# Altium project HSBNE-INPUT.PrjPcb
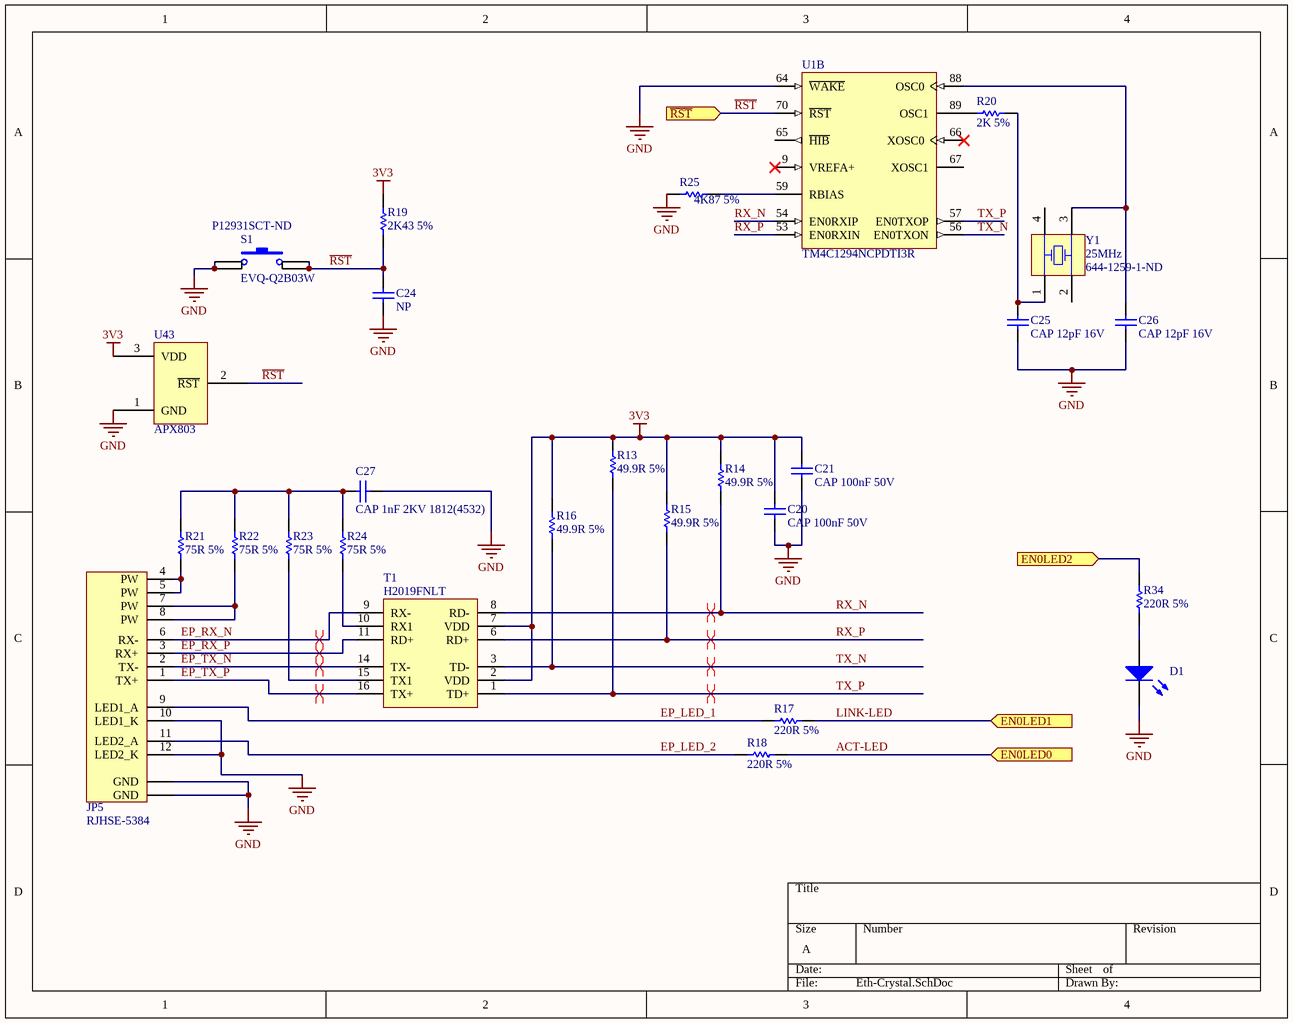
[diagram p0: Eth-Crystal.SchDoc]
3 sheets, 66 parts. Net scope: flat (ports and power ports of the same name join across sheets).
Board file: HSBNE-IO.PcbDoc
Sheets:
  Eth-Crystal.SchDoc
  Micro.SchDoc
  Power.SchDoc

## Sheet Eth-Crystal.SchDoc
size A

### Parts
C20  CAP 100nF 50V  [CAPC0603(1608)100_M]
C21  CAP 100nF 50V  [CAPC0603(1608)100_M]
C24  NP  [0603]
C25  CAP 12pF 16V  [CAPC0603(1608)100_L]
C26  CAP 12pF 16V  [CAPC0603(1608)100_L]
C27  CAP 1nF 2KV 1812(4532)  [CAPC1812(4532)230_N]
D1  LED  [LED-0603]  (value not drawn)
JP5  RJHSE-5384  [RJHSE-5484]
R13  49.9R 5%  [RESC0603(1608)_M]
R14  49.9R 5%  [RESC0603(1608)_M]
R15  49.9R 5%  [RESC0603(1608)_M]
R16  49.9R 5%  [RESC0603(1608)_M]
R17  220R 5%  [RESC0603(1608)_M]
R18  220R 5%  [RESC0603(1608)_M]
R19  2K43 5%  [RESC0603(1608)_M]
R20  2K 5%  [RESC0603(1608)_N]
R21  75R 5%  [RESC0603(1608)_N]
R22  75R 5%  [RESC0603(1608)_N]
R23  75R 5%  [RESC0603(1608)_N]
R24  75R 5%  [RESC0603(1608)_N]
R25  4K87 5%  [RESC0603(1608)_M]
R34  220R 5%  [RESC0603(1608)_M]
S1  EVQ-Q2B03W  Supplier Part Number 1: P12931SCT-ND  [TACTILE_SWITCH_SMD]
T1  H2019FNLT  [HXXXX]
U1  TM4C1294NCPDTI3R  [TI-PDT128_M]  (part B of 3)
U43  APX803  [SOT-23 - ESD]
Y1  Supplier Part Number 1: 644-1259-1-ND  [Crystal 3.2x2.5]  (hidden comment: 25MHz)

### Ports
EN0LED0 (in), EN0LED1 (in), EN0LED2 (in), ~{RST} (in)

### Nets
3V3: C20.2 C21.2 R13.2 R14.2 R15.2 R16.2 R19.2 T1.2(VDD) T1.7(VDD) U43.3(VDD)
GND: C20.1 C21.1 C24.1 C25.1 C26.1 C27.2 D1.2(K) JP5.10(LED1_K) JP5.12(LED2_K) JP5.GND1(GND) JP5.GND2(GND) R25.1 S1.1 S1.2 U1.64(~{WAKE}) U43.1(GND)
ACT-LED: R18.2 ; port EN0LED0
EP_LED_1: JP5.9(LED1_A) R17.1
EP_LED_2: JP5.11(LED2_A) R18.1
EP_RX_N: JP5.6(RX-) T1.9(RX-)
EP_RX_P: JP5.3(RX+) T1.11(RD+)
EP_TX_N: JP5.2(TX-) T1.14(TX-)
EP_TX_P: JP5.1(TX+) T1.16(TX+)
LINK-LED: R17.2 ; port EN0LED1
~{RST}: C24.2 R19.1 S1.3 S1.4 U1.70(~{RST}) U43.2(~{RST}) ; port ~{RST}
RX_N: R14.1 T1.8(RD-) U1.54(EN0RXIP)
RX_P: R15.1 T1.6(RD+) U1.53(EN0RXIN)
TX_N: R16.1 T1.3(TD-) U1.56(EN0TXON)
TX_P: R13.1 T1.1(TD+) U1.57(EN0TXOP)
NetC25_2: C25.2 R20.2 Y1.1(OSC1)
NetC26_2: C26.2 U1.88(OSC0) Y1.3(OSC2)
NetC27_1: C27.1 R21.2 R22.2 R23.2 R24.2
NetD1_1: D1.1(A) R34.1
NetJP5_4: JP5.4(PW) JP5.5(PW) R21.1
NetJP5_7: JP5.7(PW) JP5.8(PW) R22.1
NetR20_1: R20.1 U1.89(OSC1)
NetR23_1: R23.1 T1.15(TX1)
NetR24_1: R24.1 T1.10(RX1)
NetR25_2: R25.2 U1.59(RBIAS)
NetR34_2: R34.2 ; port EN0LED2

Not connected (* = marked no-connect by the designer): U1 9(VREFA+)* 65(~{HIB}) 66(XOSC0)* 67(XOSC1); Y1 2(OSC2) 4(OSC1)

### Layout directives
differential pair: EP_RX_N, EP_RX_P, EP_TX_N, EP_TX_P, RX_N, RX_P, TX_N, TX_P

### Library data of the parts
C20 C21 = CMP-1035-00010-1: CAP 100nF 50V Â±0.1pF 0603 (1608 Metric) Thickness 1mm SMD; Case-Metric: 1608; Case-EIA: 0603; Tolerance: Â±0.1pF; Technology: SMT; Value: 100nF; Max Thickness: 1 mm; Rated Voltage: 50 V
C24 = Cap_100pF: Capacitor (Semiconductor SIM Model); Value: 100pF; Published: 8-Jun-2000; LatestRevisionDate: 29-May-2009; LatestRevisionNote: IPC-7351 Footprint Added.; PackageReference: C1206; Publisher: Altium Limited; PackageDescription: Chip Capacitor
C25 C26 = CMP-1035-00602-1: CAP 12pF 16V Â±0.25pF 0603 (1608 Metric) Thickness 1mm SMD; Case-EIA: 0603; Case-Metric: 1608; Technology: SMT; Value: 12pF; Max Thickness: 1 mm; Rated Voltage: 16 V; Tolerance: Â±0.25pF
C27 = CMP-1040-00330-1: CAP 1nF 2KV Â±10% 1812 (4532 Metric) Thickness 2.3mm SMD; Case-EIA: 1812; Case-Metric: 4532; Technology: SMT; Tolerance: Â±10%; Value: 1nF; Max Thickness: 2.3 mm; Rated Voltage: 2K V
D1 = LED: Typical RED, GREEN, YELLOW, AMBER GaAs LED; Published: 8-Jun-2000; LatestRevisionDate: 17-Jul-2002; LatestRevisionNote: Re-released for DXP Platform.; PackageVersion: Feb-2002; PackageReference: 3.2X1.6X1.1; Publisher: Altium Limited; PackageDescription: SM LED; 2 Flat Leads; Supplier 1: Digi-Key; Supplier 2: Mouser; Supplier Part Number 1: 475-1409-1-ND; Supplier Part Number 2: 720-LGQ971-KN-1
JP5 = Ethernet Socket: Ethernet Socket RJ45 With Leds; Supplier 1: Digi-Key; Supplier 2: Mouser; Supplier Part Number 1: RJHSE-5384-ND; Supplier Part Number 2: 523-RJHSE-5484
R13-R16 = CMP-1012-00042-1: 49.9R 0.1W 5% 0603 (1608 Metric)  SMD; Value: 49.90 Ohm; Case-Metric: 1608; Case-EIA: 0603; Tolerance: 5 %; Technology: SMT; Power: 0.1 W
R17 R18 R34 = CMP-1012-00058-1: 220R 0.1W 5% 0603 (1608 Metric)  SMD; Case-EIA: 0603; Case-Metric: 1608; Value: 220.00 Ohm; Technology: SMT; Power: 0.1 W; Tolerance: 5 %
R19 = CMP-1012-00083-1: 2K43 0.1W 5% 0603 (1608 Metric)  SMD; Value: 2430.00 Ohm; Case-Metric: 1608; Case-EIA: 0603; Tolerance: 5 %; Technology: SMT; Power: 0.1 W
R20 = CMP-1012-00081-1: 2K 0.1W 5% 0603 (1608 Metric)  SMD; Case-Metric: 1608; Value: 2000.00 Ohm; Case-EIA: 0603; Tolerance: 5 %; Technology: SMT; Power: 0.1 W
R21-R24 = CMP-1012-00047-1: 75R 0.1W 5% 0603 (1608 Metric)  SMD; Case-EIA: 0603; Value: 75.00 Ohm; Case-Metric: 1608; Technology: SMT; Tolerance: 5 %; Power: 0.1 W
R25 = CMP-1012-00090-1: 4K87 0.1W 5% 0603 (1608 Metric)  SMD; Case-Metric: 1608; Value: 4K87.00 Ohm; Case-EIA: 0603; Tolerance: 5 %; Technology: SMT; Power: 0.1 W
S1 = SW-PB: Switch; Published: 24-Mar-1999; LatestRevisionDate: 17-Jul-2002; LatestRevisionNote: Re-released for DXP Platform.; PackageReference: SPST-2; Publisher: Altium Limited; PackageDescription: Switch; 2 Leads; Supplier 1: Digi-Key
T1 = Magnetics: Power over Ethernet Magnetic Module; Published: 24-Mar-1999; LatestRevisionDate: 17-Jul-2002; LatestRevisionNote: Re-released for DXP Platform.; PackageReference: MODULE5B; Publisher: Altium Limited; Supplier 1: Digi-Key; Supplier 2: Mouser; Supplier Part Number 2: 673-H2019FNLT
U1 = CMP-0945-00007-1: Tiva C Series Microcontroller, 1024 KB Flash, 256 KB SRAM, 12 Bit, 20 Channels, -40 to 85 degC, 128-Pin TQFP (PDT), Green (RoHS & no Sb/Br), Tape and Reel; Manufacturer: Texas Instruments; SRAM: 256 KB; ADC Resolution: 12 Bits; ADC Channels: 20; Flash: 1024 KB; Max Speed: 120 MHz; CPU: ARM Cortex-M4; Packing: Tape and Reel; Mounting Technology: Surface Mount; Eco-Plan: Green (RoHS & no Sb/Br); ComponentLink1URL: http://www.ti.com/; ComponentLink3Description: Package Specification; ComponentLink2Description: Datasheet; PartNumber: TM4C1294NCPDTI3R; DatasheetVersion: 15863.2743; ComponentLink1Description: Manufacturer URL; ComponentLink3URL: http://www.ti.com/lit/ml/mpqf013/mpqf013.pdf; Temperature Range: -40 to 85 degC; ComponentLink2URL: http://www.ti.com/lit/ds/symlink/tm4c1294ncpdt.pdf; PackageVersion: 4087726/A; PackageDescription: 128-Pin Thin Quad Flat Package, Body 14 x 14 mm, Pitch 0.4 mm; PartId: 2
U43 = APX803: IC MPU RESET CIRC 3.08V SOT23R-3; Supplier 1: Digi-Key; Supplier Part Number 1: APX803-31SRG-7DICT-ND
Y1 = Crystal_25MHz: Surface Mount Quartz Crystal; Note: PCB layout complies with manufacturer's recommendation.; Published: 17-Jul-2002; DatasheetDocument: 28-Aug-2001; PackageDocument: 28-Aug-2001; PackageReference: 91SMX; Publisher: Altium Limited; ComponentLink1Description: Manufacturer Link; ComponentLink1URL: http://www.cmac.com/mt/; ComponentLink2Description: Datasheet; ComponentLink2URL: http://www.cmac.com/mt/databook/crystals/smd/90_91_smx.pdf; Value: 25MHz; Supplier 1: Digi-Key

## Sheet Micro.SchDoc
size A
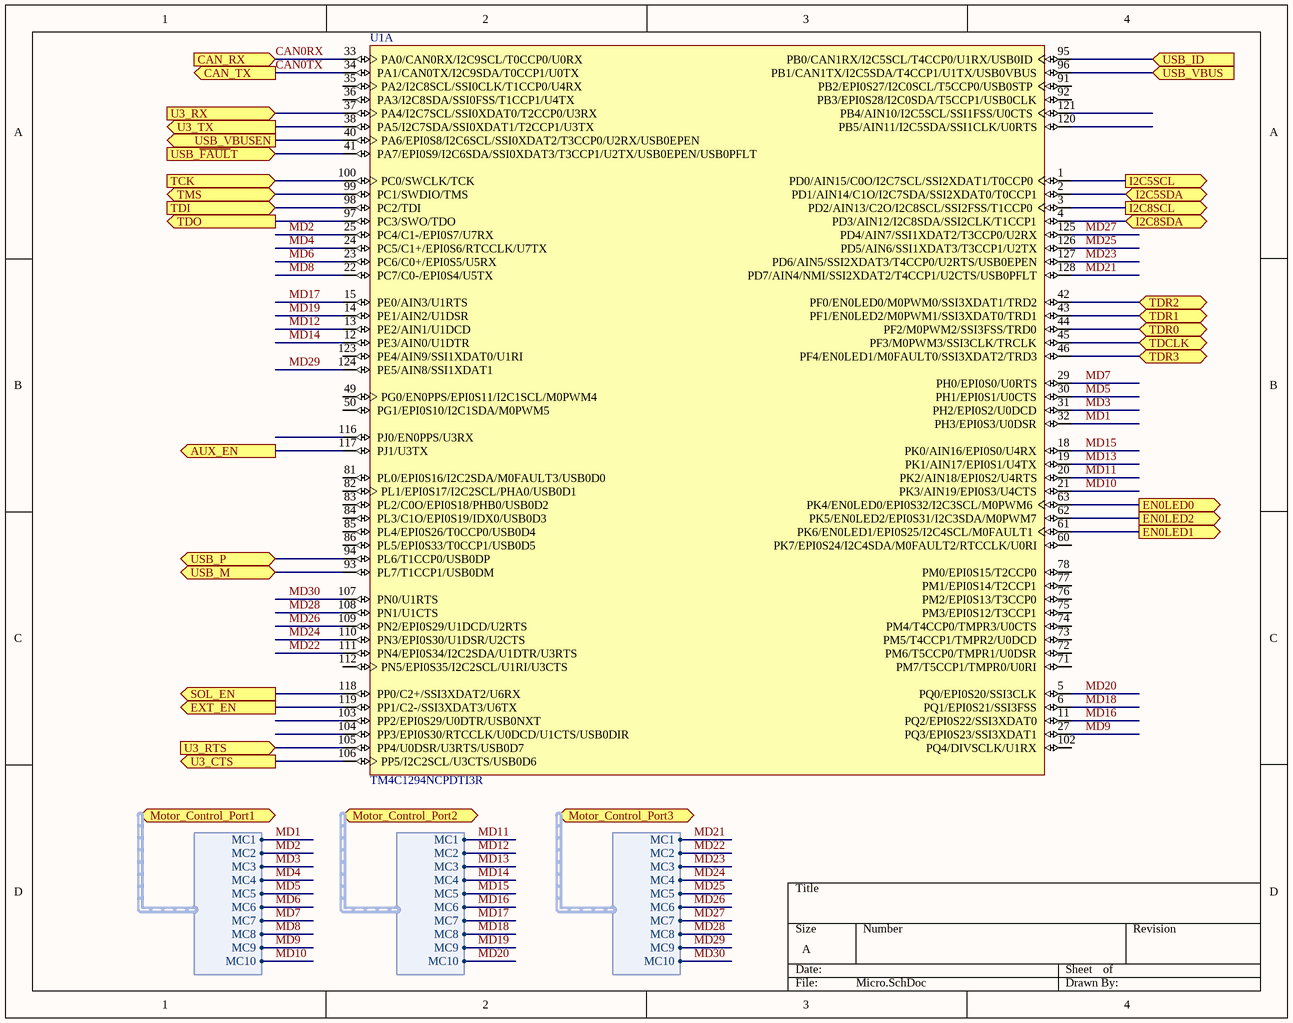
[diagram p1: Micro.SchDoc]

### Parts
U1  TM4C1294NCPDTI3R  [TI-PDT128_M]  (part A of 3)

### Ports
AUX_EN (out), CAN_RX (in), CAN_TX (out), EN0LED0 (out), EN0LED1 (out), EN0LED2 (out), EXT_EN (out), I2C5SCL (out), I2C5SDA (bidir), I2C8SCL (out), I2C8SDA (bidir), Motor_Control_Port1 (harness MCP), Motor_Control_Port2 (harness MCP), Motor_Control_Port3 (harness MCP), SOL_EN (out), TCK (in), TDCLK (bidir), TDI (in), TDO (out), TDR0 (bidir), TDR1 (bidir), TDR2 (bidir), TDR3 (bidir), TMS (bidir), U3_CTS (out), U3_RTS (in), U3_RX (in), U3_TX (out), USB_ID (in), USB_M (bidir), USB_P (bidir), USB_VBUS (in), USB_VBUSEN (out), USB_~{FAUL}T (in)

### Harnesses
MCP: MC1, MC2, MC3, MC4, MC5, MC6, MC7, MC8, MC9, MC10

### Nets
ACT-LED: U1.63(PK4/EN0LED0/EPI0S32/I2C3SCL/M0PWM6) ; port EN0LED0
CAN0RX: U1.33(PA0/CAN0RX/I2C9SCL/T0CCP0/U0RX) ; port CAN_RX
CAN0TX: U1.34(PA1/CAN0TX/I2C9SDA/T0CCP1/U0TX) ; port CAN_TX
LINK-LED: U1.61(PK6/EN0LED1/EPI0S25/I2C4SCL/M0FAULT1) ; port EN0LED1
MD1: U1.32(PH3/EPI0S3/U0DSR) ; port Motor_Control_Port1.MC1
MD2: U1.25(PC4/C1-/EPI0S7/U7RX) ; port Motor_Control_Port1.MC2
MD3: U1.31(PH2/EPI0S2/U0DCD) ; port Motor_Control_Port1.MC3
MD4: U1.24(PC5/C1+/EPI0S6/RTCCLK/U7TX) ; port Motor_Control_Port1.MC4
MD5: U1.30(PH1/EPI0S1/U0CTS) ; port Motor_Control_Port1.MC5
MD6: U1.23(PC6/C0+/EPI0S5/U5RX) ; port Motor_Control_Port1.MC6
MD7: U1.29(PH0/EPI0S0/U0RTS) ; port Motor_Control_Port1.MC7
MD8: U1.22(PC7/C0-/EPI0S4/U5TX) ; port Motor_Control_Port1.MC8
MD9: U1.27(PQ3/EPI0S23/SSI3XDAT1) ; port Motor_Control_Port1.MC9
MD10: U1.21(PK3/AIN19/EPI0S3/U4CTS) ; port Motor_Control_Port1.MC10
MD11: U1.20(PK2/AIN18/EPI0S2/U4RTS) ; port Motor_Control_Port2.MC1
MD12: U1.13(PE2/AIN1/U1DCD) ; port Motor_Control_Port2.MC2
MD13: U1.19(PK1/AIN17/EPI0S1/U4TX) ; port Motor_Control_Port2.MC3
MD14: U1.12(PE3/AIN0/U1DTR) ; port Motor_Control_Port2.MC4
MD15: U1.18(PK0/AIN16/EPI0S0/U4RX) ; port Motor_Control_Port2.MC5
MD16: U1.11(PQ2/EPI0S22/SSI3XDAT0) ; port Motor_Control_Port2.MC6
MD17: U1.15(PE0/AIN3/U1RTS) ; port Motor_Control_Port2.MC7
MD18: U1.6(PQ1/EPI0S21/SSI3FSS) ; port Motor_Control_Port2.MC8
MD19: U1.14(PE1/AIN2/U1DSR) ; port Motor_Control_Port2.MC9
MD20: U1.5(PQ0/EPI0S20/SSI3CLK) ; port Motor_Control_Port2.MC10
MD21: U1.128(PD7/AIN4/NMI/SSI2XDAT2/T4CCP1/U2CTS/USB0PFLT) ; port Motor_Control_Port3.MC1
MD22: U1.111(PN4/EPI0S34/I2C2SDA/U1DTR/U3RTS) ; port Motor_Control_Port3.MC2
MD23: U1.127(PD6/AIN5/SSI2XDAT3/T4CCP0/U2RTS/USB0EPEN) ; port Motor_Control_Port3.MC3
MD24: U1.110(PN3/EPI0S30/U1DSR/U2CTS) ; port Motor_Control_Port3.MC4
MD25: U1.126(PD5/AIN6/SSI1XDAT3/T3CCP1/U2TX) ; port Motor_Control_Port3.MC5
MD26: U1.109(PN2/EPI0S29/U1DCD/U2RTS) ; port Motor_Control_Port3.MC6
MD27: U1.125(PD4/AIN7/SSI1XDAT2/T3CCP0/U2RX) ; port Motor_Control_Port3.MC7
MD28: U1.108(PN1/U1CTS) ; port Motor_Control_Port3.MC8
MD29: U1.124(PE5/AIN8/SSI1XDAT1) ; port Motor_Control_Port3.MC9
MD30: U1.107(PN0/U1RTS) ; port Motor_Control_Port3.MC10
NetR26_2: U1.117(PJ1/U3TX) ; port AUX_EN
NetR27_2: U1.118(PP0/C2+/SSI3XDAT2/U6RX) ; port SOL_EN
NetR28_2: U1.119(PP1/C2-/SSI3XDAT3/U6TX) ; port EXT_EN
NetR34_2: U1.62(PK5/EN0LED2/EPI0S31/I2C3SDA/M0PWM7) ; port EN0LED2
NetU1_1: U1.1(PD0/AIN15/C0O/I2C7SCL/SSI2XDAT1/T0CCP0) ; port I2C5SCL
NetU1_2: U1.2(PD1/AIN14/C1O/I2C7SDA/SSI2XDAT0/T0CCP1) ; port I2C5SDA
NetU1_3: U1.3(PD2/AIN13/C2O/I2C8SCL/SSI2FSS/T1CCP0) ; port I2C8SCL
NetU1_4: U1.4(PD3/AIN12/I2C8SDA/SSI2CLK/T1CCP1) ; port I2C8SDA
NetU1_37: U1.37(PA4/I2C7SCL/SSI0XDAT0/T2CCP0/U3RX) ; port U3_RX
NetU1_38: U1.38(PA5/I2C7SDA/SSI0XDAT1/T2CCP1/U3TX) ; port U3_TX
NetU1_40: U1.40(PA6/EPI0S8/I2C6SCL/SSI0XDAT2/T3CCP0/U2RX/USB0EPEN) ; port USB_VBUSEN
NetU1_41: U1.41(PA7/EPI0S9/I2C6SDA/SSI0XDAT3/T3CCP1/U2TX/USB0EPEN/USB0PFLT) ; port USB_~{FAUL}T
NetU1_42: U1.42(PF0/EN0LED0/M0PWM0/SSI3XDAT1/TRD2) ; port TDR2
NetU1_43: U1.43(PF1/EN0LED2/M0PWM1/SSI3XDAT0/TRD1) ; port TDR1
NetU1_44: U1.44(PF2/M0PWM2/SSI3FSS/TRD0) ; port TDR0
NetU1_45: U1.45(PF3/M0PWM3/SSI3CLK/TRCLK) ; port TDCLK
NetU1_46: U1.46(PF4/EN0LED1/M0FAULT0/SSI3XDAT2/TRD3) ; port TDR3
NetU1_93: U1.93(PL7/T1CCP1/USB0DM) ; port USB_M
NetU1_94: U1.94(PL6/T1CCP0/USB0DP) ; port USB_P
NetU1_95: U1.95(PB0/CAN1RX/I2C5SCL/T4CCP0/U1RX/USB0ID) ; port USB_ID
NetU1_96: U1.96(PB1/CAN1TX/I2C5SDA/T4CCP1/U1TX/USB0VBUS) ; port USB_VBUS
NetU1_97: U1.97(PC3/SWO/TDO) ; port TDO
NetU1_98: U1.98(PC2/TDI) ; port TDI
NetU1_99: U1.99(PC1/SWDIO/TMS) ; port TMS
NetU1_100: U1.100(PC0/SWCLK/TCK) ; port TCK
NetU1_105: U1.105(PP4/U0DSR/U3RTS/USB0D7) ; port U3_RTS
NetU1_106: U1.106(PP5/I2C2SCL/U3CTS/USB0D6) ; port U3_CTS

Not connected (* = marked no-connect by the designer): U1 35(PA2/I2C8SCL/SSI0CLK/T1CCP0/U4RX) 36(PA3/I2C8SDA/SSI0FSS/T1CCP1/U4TX) 49(PG0/EN0PPS/EPI0S11/I2C1SCL/M0PWM4) 50(PG1/EPI0S10/I2C1SDA/M0PWM5) 60(PK7/EPI0S24/I2C4SDA/M0FAULT2/RTCCLK/U0RI) 71(PM7/T5CCP1/TMPR0/U0RI) 72(PM6/T5CCP0/TMPR1/U0DSR) 73(PM5/T4CCP1/TMPR2/U0DCD) 74(PM4/T4CCP0/TMPR3/U0CTS) 75(PM3/EPI0S12/T3CCP1) 76(PM2/EPI0S13/T3CCP0) 77(PM1/EPI0S14/T2CCP1) 78(PM0/EPI0S15/T2CCP0) 81(PL0/EPI0S16/I2C2SDA/M0FAULT3/USB0D0) 82(PL1/EPI0S17/I2C2SCL/PHA0/USB0D1) 83(PL2/C0O/EPI0S18/PHB0/USB0D2) 84(PL3/C1O/EPI0S19/IDX0/USB0D3) 85(PL4/EPI0S26/T0CCP0/USB0D4) 86(PL5/EPI0S33/T0CCP1/USB0D5) 91(PB2/EPI0S27/I2C0SCL/T5CCP0/USB0STP) 92(PB3/EPI0S28/I2C0SDA/T5CCP1/USB0CLK) 102(PQ4/DIVSCLK/U1RX) 103(PP2/EPI0S29/U0DTR/USB0NXT) 104(PP3/EPI0S30/RTCCLK/U0DCD/U1CTS/USB0DIR) 112(PN5/EPI0S35/I2C2SCL/U1RI/U3CTS) 116(PJ0/EN0PPS/U3RX) 120(PB5/AIN11/I2C5SDA/SSI1CLK/U0RTS) 121(PB4/AIN10/I2C5SCL/SSI1FSS/U0CTS) 123(PE4/AIN9/SSI1XDAT0/U1RI)

### Library data of the parts
U1 = CMP-0945-00007-1: as U1 on sheet Eth-Crystal; Packing: Tape and Reel; Mounting Technology: Surface Mount; Eco-Plan: Green (RoHS & no Sb/Br); ComponentLink1URL: http://www.ti.com/; ComponentLink3Description: Package Specification; ComponentLink2Description: Datasheet; PartNumber: TM4C1294NCPDTI3R; DatasheetVersion: 15863.2743; ComponentLink1Description: Manufacturer URL; ComponentLink3URL: http://www.ti.com/lit/ml/mpqf013/mpqf013.pdf; Temperature Range: -40 to 85 degC; ComponentLink2URL: http://www.ti.com/lit/ds/symlink/tm4c1294ncpdt.pdf; PackageVersion: 4087726/A; PackageDescription: 128-Pin Thin Quad Flat Package, Body 14 x 14 mm, Pitch 0.4 mm

## Sheet Power.SchDoc
size A
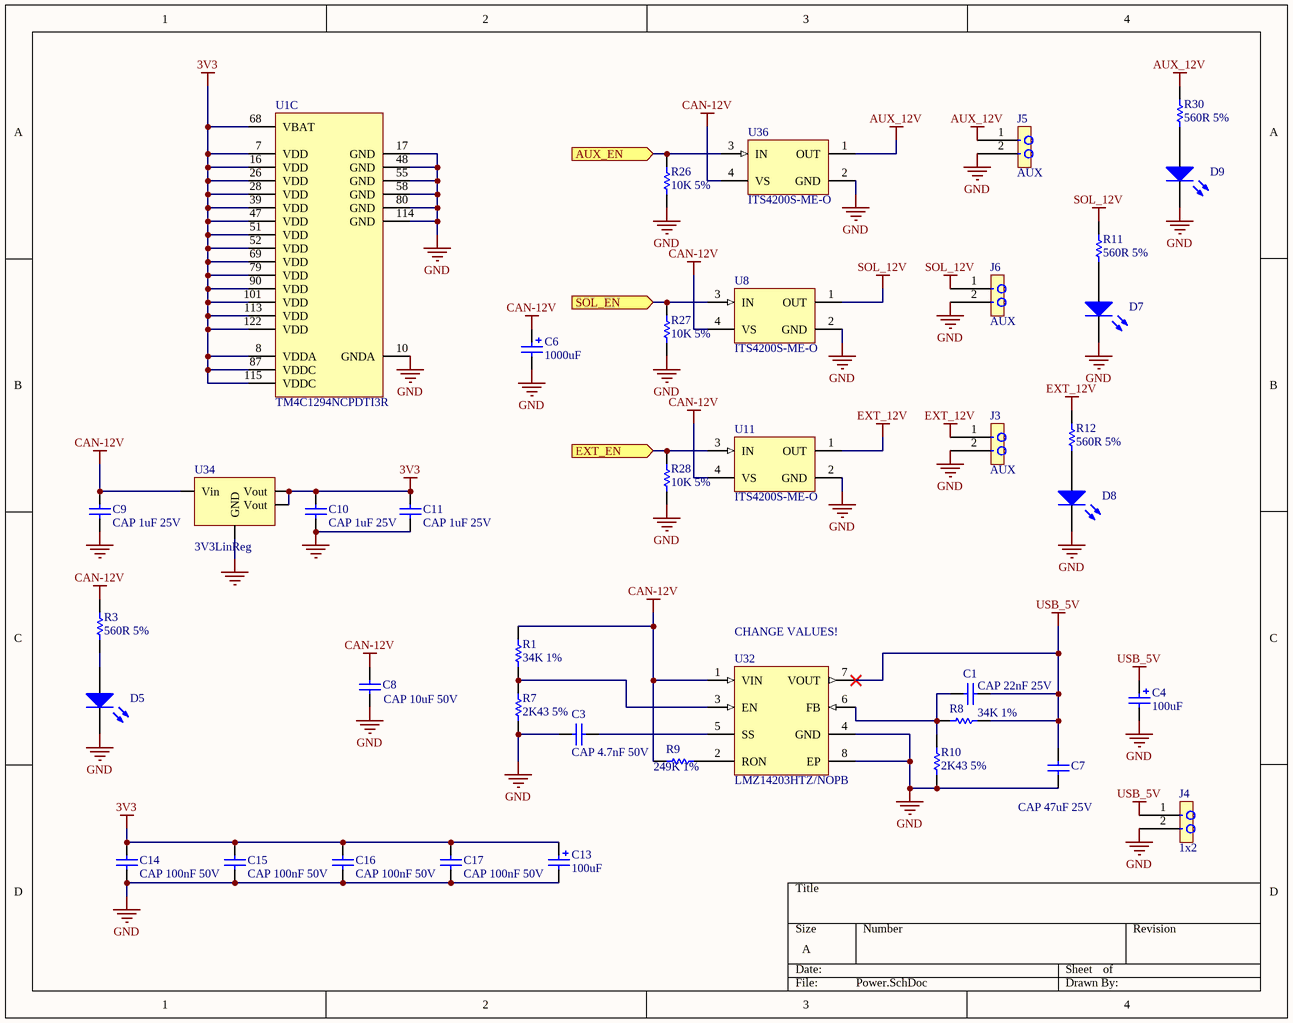
[diagram p2: Power.SchDoc]

### Parts
C1  CAP 22nF 25V  [CAPC0805(2012)100_M]
C3  CAP 4.7nF 50V  [CAPC0603(1608)100_M]
C4  100uF  [PANASONIC_C]
C6  1000uF  [PANASONIC_H13]
C7  CAP 47uF 25V  [CAPC1206(3216)100_L]
C8  CAP 10uF 50V  [CAPC1206(3216)190_M]
C9  CAP 1uF 25V  [CAPC0603(1608)100_M]
C10  CAP 1uF 25V  [CAPC0603(1608)100_M]
C11  CAP 1uF 25V  [CAPC0603(1608)100_M]
C13  100uF  [PANASONIC_C]
C14  CAP 100nF 50V  [CAPC0603(1608)100_M]
C15  CAP 100nF 50V  [CAPC0603(1608)100_M]
C16  CAP 100nF 50V  [CAPC0603(1608)100_M]
C17  CAP 100nF 50V  [CAPC0603(1608)100_M]
D5  LED  [LED-0603]  (value not drawn)
D7  LED  [LED-0603]  (value not drawn)
D8  LED  [LED-0603]  (value not drawn)
D9  LED  [LED-0603]  (value not drawn)
J3  AUX  [M5569-2]
J4  1x2  [1X2]
J5  AUX  [M5569-2]
J6  AUX  [M5569-2]
R1  34K 1%  [RESC0603(1608)_M]
R3  560R 5%  [RESC0603(1608)_M]
R7  2K43 5%  [RESC0603(1608)_M]
R8  34K 1%  [RESC0603(1608)_M]
R9  249K 1%  [RESC0603(1608)_M]
R10  2K43 5%  [RESC0603(1608)_M]
R11  560R 5%  [RESC0603(1608)_M]
R12  560R 5%  [RESC0603(1608)_M]
R26  10K 5%  [RESC0603(1608)_N]
R27  10K 5%  [RESC0603(1608)_N]
R28  10K 5%  [RESC0603(1608)_N]
R30  560R 5%  [RESC0603(1608)_M]
U1  TM4C1294NCPDTI3R  [TI-PDT128_M]  (part C of 3)
U8  ITS4200S-ME-O  [INF-SOT223_M]
U11  ITS4200S-ME-O  [INF-SOT223_M]
U32  LMZ14203HTZ/NOPB  [TZA07A_V]
U34  3V3LinReg  [SOT-223]
U36  ITS4200S-ME-O  [INF-SOT223_M]

### Ports
AUX_EN (in), EXT_EN (in), SOL_EN (in)

### Nets
3V3: C10.2 C11.2 C13.+ C14.2 C15.2 C16.2 C17.2 U1.7(VDD) U1.8(VDDA) U1.16(VDD) U1.26(VDD) U1.28(VDD) U1.39(VDD) U1.47(VDD) U1.51(VDD) U1.52(VDD) U1.68(VBAT) U1.69(VDD) U1.79(VDD) U1.87(VDDC) U1.90(VDD) U1.101(VDD) U1.113(VDD) U1.115(VDDC) U1.122(VDD) U34.2(Vout) U34.4(Vout)
AUX_12V: J5.1 R30.2 U36.1(OUT)
CAN-12V: C6.+ C8.1 C9.2 R1.2 R3.2 R9.1 U8.4(VS) U11.4(VS) U32.1(VIN) U34.3(Vin) U36.4(VS)
EXT_12V: J3.1 R12.2 U11.1(OUT)
GND: C3.1 C4.- C6.- C7.2 C8.2 C9.1 C10.1 C11.1 C13.- C14.1 C15.1 C16.1 C17.1 D5.2(K) D7.2(K) D8.2(K) D9.2(K) J3.2 J4.2 J5.2 J6.2 R7.1 R10.1 R26.1 R27.1 R28.1 U1.10(GNDA) U1.17(GND) U1.48(GND) U1.55(GND) U1.58(GND) U1.80(GND) U1.114(GND) U8.2(GND) U11.2(GND) U32.4(GND) U32.8(EP) U34.1(GND) U36.2(GND)
SOL_12V: J6.1 R11.2 U8.1(OUT)
USB_5V: C1.2 C4.+ C7.1 J4.1 R8.2 U32.7(VOUT)
NetC1_1: C1.1 R8.1 R10.2 U32.6(FB)
NetC3_2: C3.2 U32.5(SS)
NetD5_1: D5.1(A) R3.1
NetD7_1: D7.1(A) R11.1
NetD8_1: D8.1(A) R12.1
NetD9_1: D9.1(A) R30.1
NetR1_1: R1.1 R7.2 U32.3(EN)
NetR9_2: R9.2 U32.2(RON)
NetR26_2: R26.2 U36.3(IN) ; port AUX_EN
NetR27_2: R27.2 U8.3(IN) ; port SOL_EN
NetR28_2: R28.2 U11.3(IN) ; port EXT_EN

### Notes on the sheet
- (near U32) CHANGE VALUES!

### Library data of the parts
C1 = CMP-1036-04051-1: CAP 22nF 25V Â±5% 0805 (2012 Metric) Thickness 1mm SMD; Case-Metric: 2012; Case-EIA: 0805; Technology: SMT; Max Thickness: 1 mm; Value: 22nF; Rated Voltage: 25 V; Tolerance: Â±5%
C3 = CMP-1035-00333-1: CAP 4.7nF 50V Â±20% 0603 (1608 Metric) Thickness 1mm SMD; Case-EIA: 0603; Case-Metric: 1608; Max Thickness: 1 mm; Rated Voltage: 50 V; Technology: SMT; Tolerance: Â±20%; Value: 4.7nF
C4 C13 = Cap_Polarized_100uF: Polarized Capacitor (Surface Mount); Published: 8-Jun-2000; LatestRevisionDate: 29-May-2009; LatestRevisionNote: IPC-7351 Footprint Added.; PackageReference: C0805; Publisher: Altium Limited; PackageDescription: Chip Capacitor; Value: 100uF; Supplier 1: Digi-Key; Supplier 2: Mouser; Supplier Part Number 1: PCE4718CT-ND; Supplier Part Number 2: 667-EEE-HAJ101WAR
C6 = Cap_Polarized_1000uF: Polarized Capacitor (Surface Mount); Published: 8-Jun-2000; LatestRevisionDate: 29-May-2009; LatestRevisionNote: IPC-7351 Footprint Added.; PackageReference: C0805; Publisher: Altium Limited; PackageDescription: Chip Capacitor; Value: 1000uF; Supplier 1: Digi-Key; Supplier 2: Mouser; Supplier Part Number 1: PCE3462CT-ND; Supplier Part Number 2: 140-VE102M1ETR1313
C7 = CMP-1037-00376-1: CAP 47uF 25V Â±0.25pF 1206 (3216 Metric) Thickness 1mm SMD; Case-EIA: 1206; Case-Metric: 3216; Technology: SMT; Max Thickness: 1 mm; Value: 47uF; Tolerance: Â±0.25pF; Rated Voltage: 25 V
C8 = CMP-1037-04982-1: CAP 10uF 50V Â±10% 1206 (3216 Metric) Thickness 1.9mm SMD; Case-EIA: 1206; Case-Metric: 3216; Technology: SMT; Tolerance: Â±10%; Max Thickness: 1.9 mm; Value: 10uF; Rated Voltage: 50 V
C9-C11 = CMP-1035-00037-1: CAP 1uF 25V Â±0.25pF 0603 (1608 Metric) Thickness 1mm SMD; Case-Metric: 1608; Case-EIA: 0603; Tolerance: Â±0.25pF; Max Thickness: 1 mm; Value: 1uF; Technology: SMT; Rated Voltage: 25 V
C14-C17 = CMP-1035-00010-1: as C20 on sheet Eth-Crystal; Tolerance: Â±0.1pF; Technology: SMT; Value: 100nF; Max Thickness: 1 mm; Rated Voltage: 50 V
D5 D7-D9 = LED: as D1 on sheet Eth-Crystal; Published: 8-Jun-2000; LatestRevisionDate: 17-Jul-2002; LatestRevisionNote: Re-released for DXP Platform.; PackageVersion: Feb-2002; PackageReference: 3.2X1.6X1.1; Publisher: Altium Limited; PackageDescription: SM LED; 2 Flat Leads; Supplier 1: Digi-Key; Supplier 2: Mouser; Supplier Part Number 1: 475-1409-1-ND; Supplier Part Number 2: 720-LGQ971-KN-1
J3-J6 = CON2: 6.35mm right-angle 90° male spade terminal PCB mount; CID: 643; CID2: 643; CID3: 643
R1 R8 = CMP-1012-00682-1: 34K 0.1W 1% 0603 (1608 Metric)  SMD; Value: 34000.00 Ohm; Case-EIA: 0603; Case-Metric: 1608; Tolerance: 1 %; Power: 0.1 W; Technology: SMT
R3 R11 R12 R30 = CMP-1012-00068-1: 560R 0.1W 5% 0603 (1608 Metric)  SMD; Case-EIA: 0603; Case-Metric: 1608; Value: 560.00 Ohm; Tolerance: 5 %; Technology: SMT; Power: 0.1 W
R7 R10 = CMP-1012-00083-1: as R19 on sheet Eth-Crystal; Tolerance: 5 %; Technology: SMT; Power: 0.1 W
R9 = CMP-1012-00779-1: 249K 0.1W 1% 0603 (1608 Metric)  SMD; Case-Metric: 1608; Case-EIA: 0603; Value: 249000.00 Ohm; Technology: SMT; Power: 0.1 W; Tolerance: 1 %
R26-R28 = CMP-1012-00098-1: 10K 0.1W 5% 0603 (1608 Metric)  SMD; Case-EIA: 0603; Value: 10000.00 Ohm; Case-Metric: 1608; Technology: SMT; Tolerance: 5 %; Power: 0.1 W
U1 = CMP-0945-00007-1: as U1 on sheet Eth-Crystal; Packing: Tape and Reel; Mounting Technology: Surface Mount; Eco-Plan: Green (RoHS & no Sb/Br); ComponentLink1URL: http://www.ti.com/; ComponentLink3Description: Package Specification; ComponentLink2Description: Datasheet; PartNumber: TM4C1294NCPDTI3R; DatasheetVersion: 15863.2743; ComponentLink1Description: Manufacturer URL; ComponentLink3URL: http://www.ti.com/lit/ml/mpqf013/mpqf013.pdf; Temperature Range: -40 to 85 degC; ComponentLink2URL: http://www.ti.com/lit/ds/symlink/tm4c1294ncpdt.pdf; PackageVersion: 4087726/A; PackageDescription: 128-Pin Thin Quad Flat Package, Body 14 x 14 mm, Pitch 0.4 mm; PartId: 2
U8 U11 U36 = CMP-1095-00143-1: Smart High-Side NMOS-Power Switch, 11 to 45 V Operating, -40 to 125 degC, SOT223, Reel, Green; Manufacturer: Infineon; Channels: 1; IL (nom)min - one channel active: 0.7Â A; Green: TRUE; Operating Voltage Range (min): 11 V; RON (max) @ Tj max: 320 mOhm; Operating Voltage Range (max): 45 V; Ptot (max): 1.4Â W; toff (max): 150 us; RON @ 25 degC: 200 mOhm (max); IL (SCp): 1.4Â A; IL (SC): 1.1Â A; ton (max): 100 us; Packing: Reel; IL (nom)min - all channels active: 0.7Â A; ComponentLink2Description: Datasheet; Load Current (typ): 0.7Â A; ComponentLink1Description: Manufacturer URL; PackageDescription: 4-Pin Small Outline Transistor Package, 6.5 x 3.5 mm Body, 2.3 mm Pitch; Mounting Technology: Surface Mount; ComponentLink1URL: http://www.infineon.com/; ComponentLink2URL: http://www.infineon.com/dgdl/ITS4200S-ME-O_01092012S.pdf?folderId=db3a304412b407950112b408e8c90004&fileId=db3a304339dcf4b1013a013fb7455740; ComponentLink3URL: http://www.infineon.com/dgdl/SOT223-Package_Overview.pdf?folderId=db3a30431936bc4b0119530470b03c3d&fileId=db3a30431936bc4b0119531d40b93c5c; PackageReference: SOT223; ComponentLink3Description: Package Specification; PartNumber: ITS4200S-ME-O; DatasheetVersion: Rev. 1.0; PackageVersion: Apr-08
U32 = CMP-0069-02044-1: 3A SIMPLE SWITCHERÂ® Power Module with 42V Maximum Input for High Voltage Output, 7-pin TO-PMOD, Pb-Free, 250 Reel; Manufacturer: National Semiconductor; PowerWise: Y; PackageTopMarking: NSUZXYTTE#*LMZ14203*HTZ; ComponentLink3URL: http://www.national.com/packaging/folders/tza07a.html; ComponentLink2URL: http://www.national.com/pf/LM/LMZ14203H.html; ComponentLink1Description: LMZ14203 Datasheet; PackageVersion: revD, Apr-2011; RoHS: Y; DatasheetVersion: Jan-2011; PinCount: 7; CompType: Switcher; PackageDescription: TO-PMOD-7, 10.16 x 9.85 x 4.57 mm Body, 7 Lead, 1.27mm Pitch, Surface Mount; PackageReference: TZA07A; ComponentLink1URL: http://www.national.com/ds/LM/LMZ14203H.pdf; ComponentLink3Description: TZA07A Package Page; ComponentLink2Description: LMZ14203H Web Page
U34 = AZ1117EH: Reg 1A 3V3 OUT SIP VERT; Supplier 1: Digi-Key; Supplier Part Number 1: AZ1117EH-3.3TRG1DICT-ND

## Nets that join several sheets
3V3: Eth-Crystal (10 pins), Power (27 pins)
GND: Eth-Crystal (16 pins), Power (39 pins)
ACT-LED: Eth-Crystal (R18.2), Micro (U1.63)
LINK-LED: Eth-Crystal (R17.2), Micro (U1.61)
NetR26_2: Micro (U1.117), Power (R26.2 U36.3)
NetR27_2: Micro (U1.118), Power (R27.2 U8.3)
NetR28_2: Micro (U1.119), Power (R28.2 U11.3)
NetR34_2: Eth-Crystal (R34.2), Micro (U1.62)